# EAGLE design untitled (EAGLE 9.5.2)
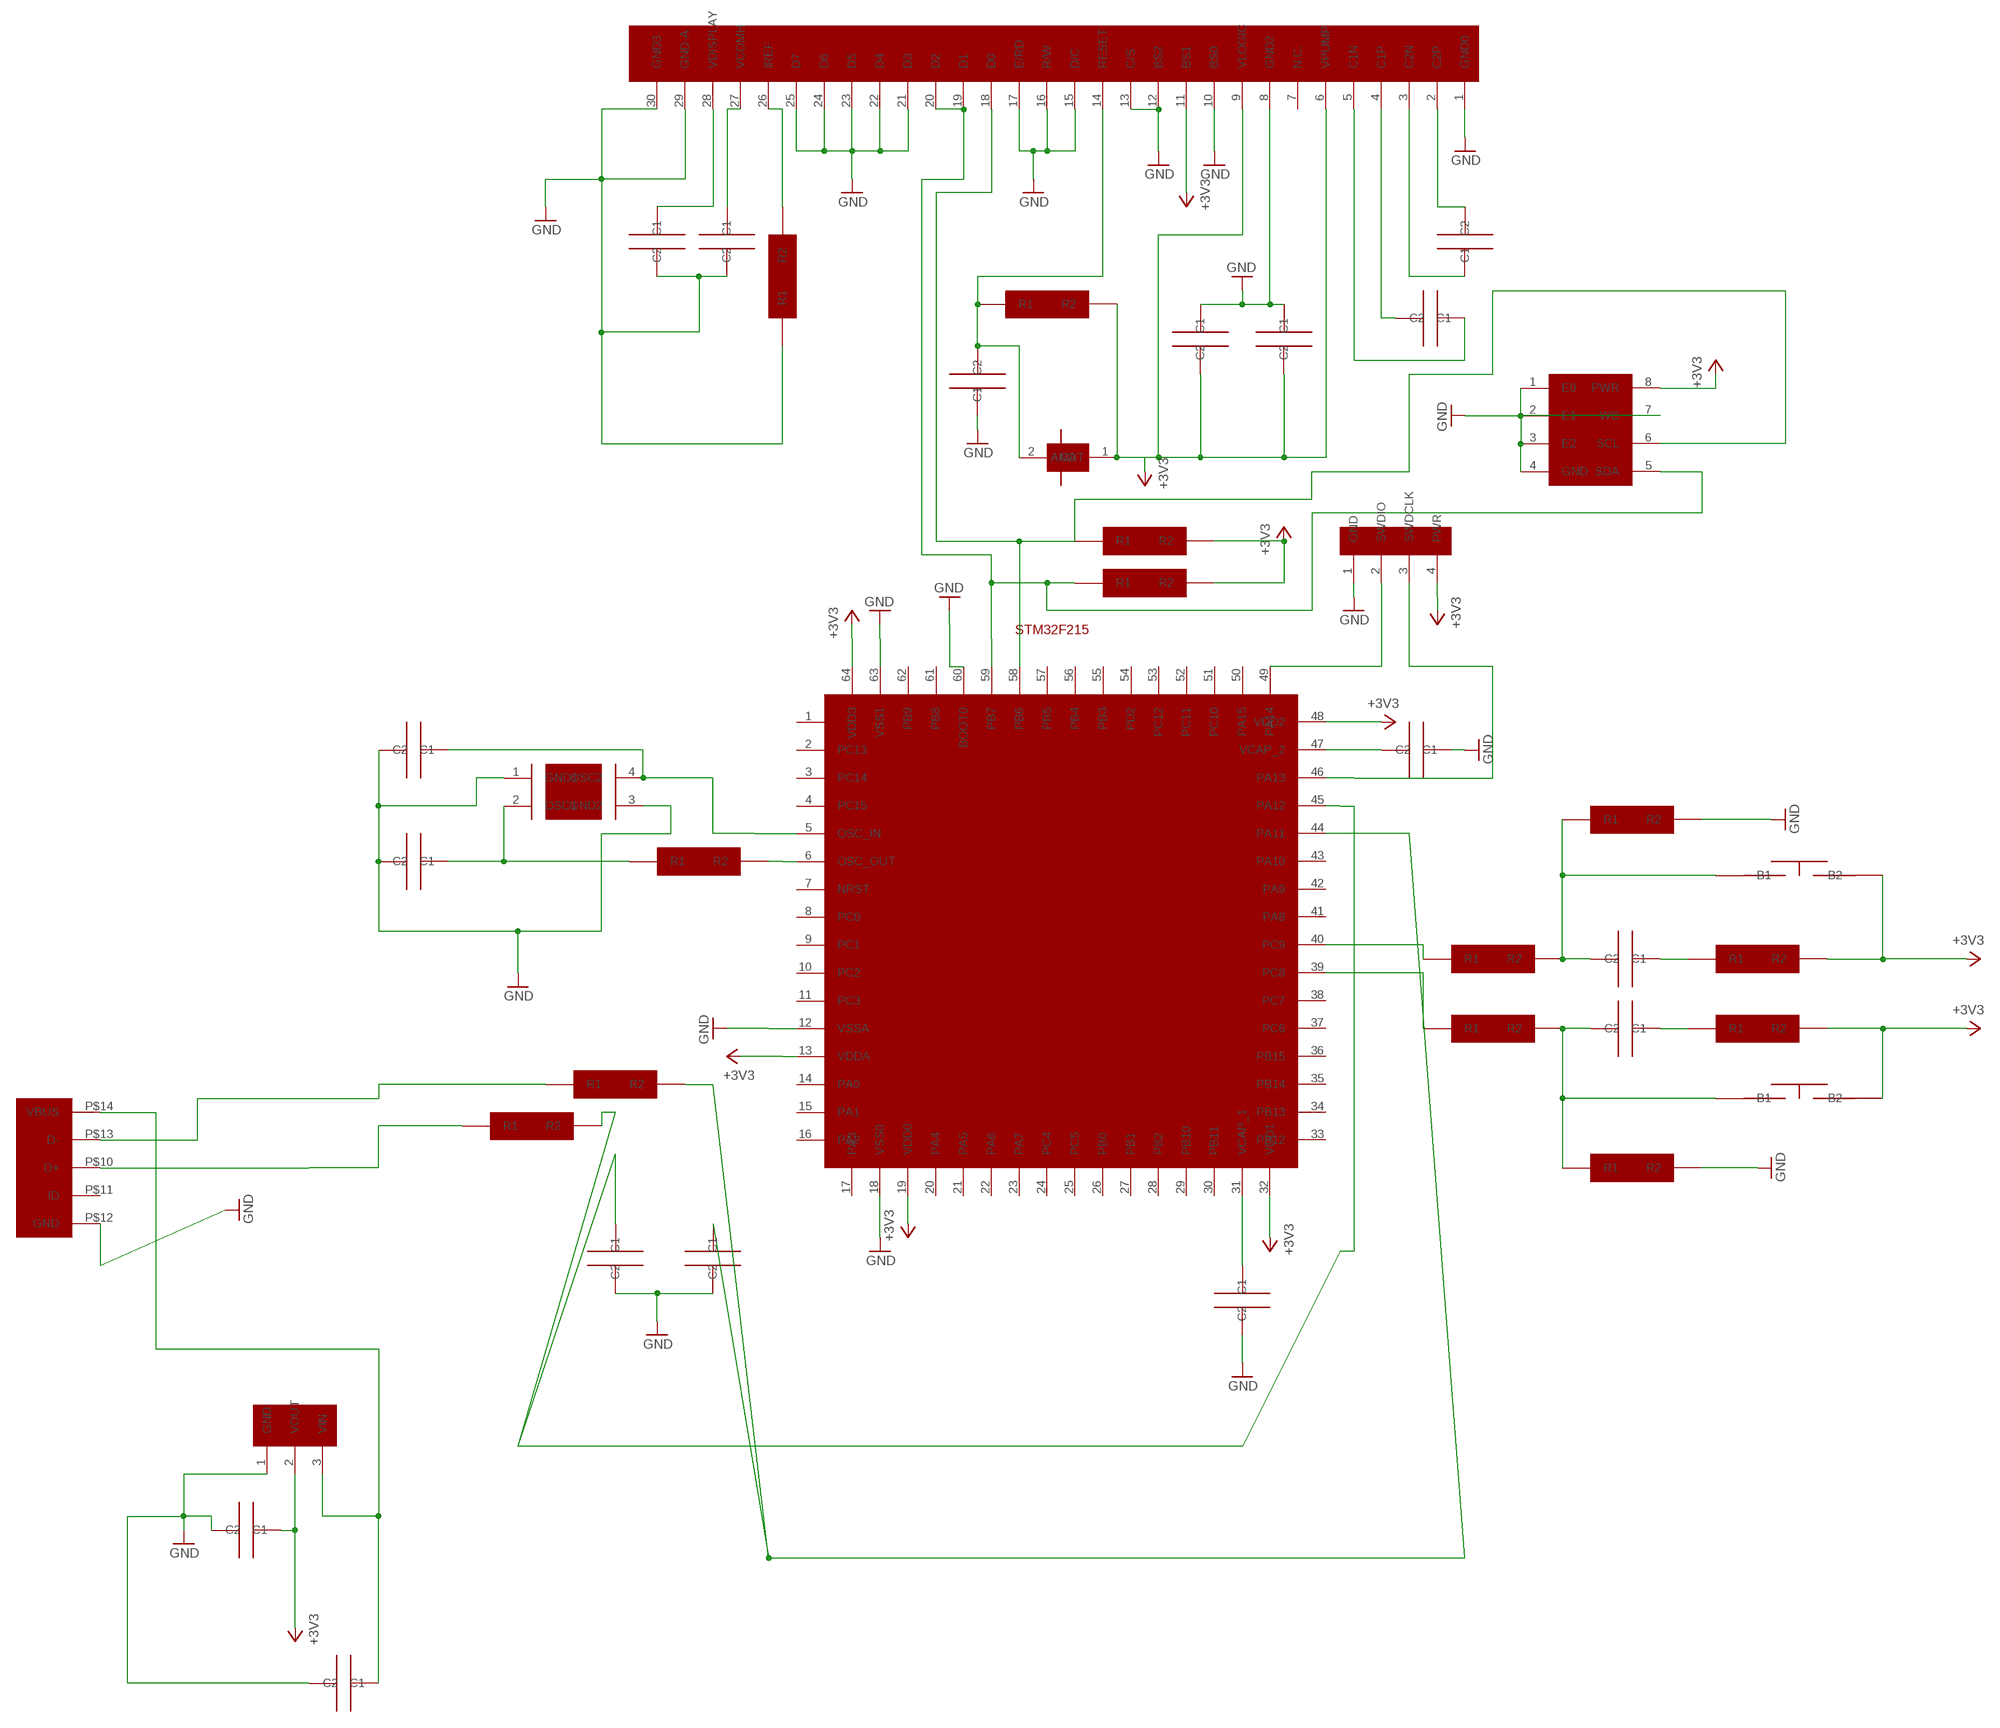
[diagram p0: schematic, sheet 1]

## Parts
C3  10мкф  C0805  [0805]
C4  22мкф  C0805  [0805]
C10  100нф  C0805  [0805]
C11  100нф  C0805  [0805]
C28  8пф  C0805  [0805]
C29  8пф  C0805  [0805]
C30  47пф  C0805  [0805]
C31  47пф  C0805  [0805]
C36  2.2мкф  C0805  [0805]
C37  2.2мкф  C0805  [0805]
C39  1мкф  C0805  [0805]
C40  1мкф  C0805  [0805]
C41  1мкф  C0805  [0805]
C42  1мкф  C0805  [0805]
C44  4.7мкф  C0805  [0805]
C46  2.2мкф  C0805  [0805]
C47  4.7мкф  C0805  [0805]
R2  330  R0805  [0805]
R3  330  R0805  [0805]
R6  100  R0805  [0805]
R7  100  R0805  [0805]
R8  10к  R0805  [0805]
R9  10к  R0805  [0805]
R14  220k  R0805  [0805]
R15  220k  R0805  [0805]
R32  820  R0805  [0805]
R33  22  R0805  [0805]
R34  22  R0805  [0805]
R43  4.7к  R0805  [0805]
R48  910к  R0805  [0805]
U$1  STM32F215RESTM32  [QFP50P1300X1300X120-64N]
U$2  AMS1117  [SOT229P729X180-4N]
U$3  I2CMEMORY  [SOIC127P600X175-8N]
U$4  USBUSBT  [USBT]
U$5  SWDSWDD  [HDRV4W64P254_1X4_1016X508X838B]
U$18  BUTTON  [BUTTON]
U$19  BUTTON  [BUTTON]
U$26  NX2520SA  [NX2520SA]
U$38  SSD1306  [SSD1306]
U$45  ESD  [ESD]

## Nets
+3V3: C4.2(C2) C41.1(C1) C42.1(C1) R6.2(R2) R7.2(R2) R8.2(R2) R9.2(R2) R43.2(R2) U$1.13(VDDA) U$1.19(VDD0) U$1.32(VDD1) U$1.48(VDD2) U$1.64(VDD3) U$2.2(VOUT) U$3.8(PWR) U$5.4(PWR) U$18.2(B2) U$19.2(B2) U$38.6(VPUMP) U$38.9(VLOGIC) U$38.11(BS1) U$45.1(ANO)
GND: C3.1(C1) C4.1(C1) C28.1(C1) C29.1(C1) C30.1(C1) C31.1(C1) C36.1(C1) C37.2(C2) C41.2(C2) C42.2(C2) C44.2(C2) C46.1(C1) C47.1(C1) R14.2(R2) R15.2(R2) R48.1(R1) U$1.12(VSSA) U$1.18(VSS0) U$1.60(BOOT0) U$1.63(VSS1) U$2.1(GND) U$3.1(E0) U$3.2(E1) U$3.3(E2) U$3.4(GND) U$3.7(WC) U$4.P$12(GND) U$5.1(GND) U$26.1(GND1) U$26.3(GND2) U$38.1(GND0) U$38.8(GND2) U$38.10(BS0) U$38.12(BS2) U$38.13(C/S) U$38.15(D/C) U$38.16(R/W) U$38.17(E/RD) U$38.21(D3) U$38.22(D4) U$38.23(D5) U$38.24(D6) U$38.25(D7) U$38.29(GND-A) U$38.30(GND3)
N$1: C30.2(C2) R33.2(R2) U$1.44(PA11)
N$5: C11.1(C1) R3.2(R2) R15.1(R1) U$19.1(B1)
N$6: C11.2(C2) R7.1(R1)
N$7: C10.1(C1) R2.2(R2) R14.1(R1) U$18.1(B1)
N$8: C10.2(C2) R6.1(R1)
N$17: R32.2(R2) U$1.6(OSC_OUT)
N$18: C28.2(C2) U$1.5(OSC_IN) U$26.4(OSC2)
N$19: C29.2(C2) R32.1(R1) U$26.2(OSC1)
N$21: C31.2(C2) R34.2(R2) U$1.45(PA12)
N$22: C36.2(C2) U$1.31(VCAP_1)
N$23: R33.1(R1) U$4.P$13(D-)
N$24: R34.1(R1) U$4.P$10(D+)
N$25: C37.1(C1) U$1.47(VCAP_2)
N$28: R3.1(R1) U$1.39(PC8)
N$29: R2.1(R1) U$1.40(PC9)
N$34: C39.1(C1) U$38.2(C2P)
N$35: C39.2(C2) U$38.3(C2N)
N$36: C40.1(C1) U$38.4(C1P)
N$37: C40.2(C2) U$38.5(C1N)
N$38: C44.1(C1) R43.1(R1) U$38.14(RESET) U$45.2(CAT)
N$40: C3.2(C2) U$2.3(VIN) U$4.P$14(VBUS)
N$43: R48.2(R2) U$38.26(IREF)
N$44: C47.2(C2) U$38.27(VCOMH)
N$45: C46.2(C2) U$38.28(VDISPLAY)
N$47: R9.1(R1) U$1.59(PB7) U$3.5(SDA) U$38.19(D1) U$38.20(D2)
N$48: R8.1(R1) U$1.58(PB6) U$3.6(SCL) U$38.18(D0)
N$51: U$1.49(PA14) U$5.2(SWDIO)
N$52: U$1.46(PA13) U$5.3(SWDCLK)
Unconnected: U$1.2(PC13) U$1.3(PC14) U$1.4(PC15) U$1.7(NRST) U$1.8(PC0) U$1.9(PC1) U$1.10(PC2) U$1.11(PC3) U$1.14(PA0) U$1.15(PA1) U$1.16(PA2) U$1.17(PA3) U$1.20(PA4) U$1.21(PA5) U$1.22(PA6) U$1.23(PA7) U$1.24(PC4) U$1.25(PC5) U$1.26(PB0) U$1.27(PB1) U$1.28(PB2) U$1.29(PB10) U$1.30(PB11) U$1.33(PB12) U$1.34(PB13) U$1.35(PB14) U$1.36(PB15) U$1.37(PC6) U$1.38(PC7) U$1.41(PA8) U$1.42(PA9) U$1.43(PA10) U$1.50(PA15) U$1.51(PC10) U$1.52(PC11) U$1.53(PC12) U$1.54(PD2) U$1.55(PB3) U$1.56(PB4) U$1.57(PB5) U$1.61(PB8) U$1.62(PB9) U$4.P$11(ID) U$38.7(N.C.)

## Power pins joined to a net without a drawn wire
VBAT: U$1.1(VBAT)

## Library data of the parts
C3 C4 C10 C11 C28-C31 C36 C37 C39-C42 C44 C46 C47 = IDMLib:C0805
R2 R3 R6-R9 R14 R15 R32-R34 R43 R48 = IDMLib:R0805
U$1 = IDMLib:STM32F215RE
U$2 = IDMLib:AMS1117
U$3 = IDMLib:I2CMEMORY
U$4 = IDMLib:USB
U$5 = IDMLib:SWD
U$18 U$19 = IDMLib:BUTTON
U$26 = IDMLib:NX2520SA
U$38 = IDMLib:SSD1306
U$45 = IDMLib:ESD

## Board
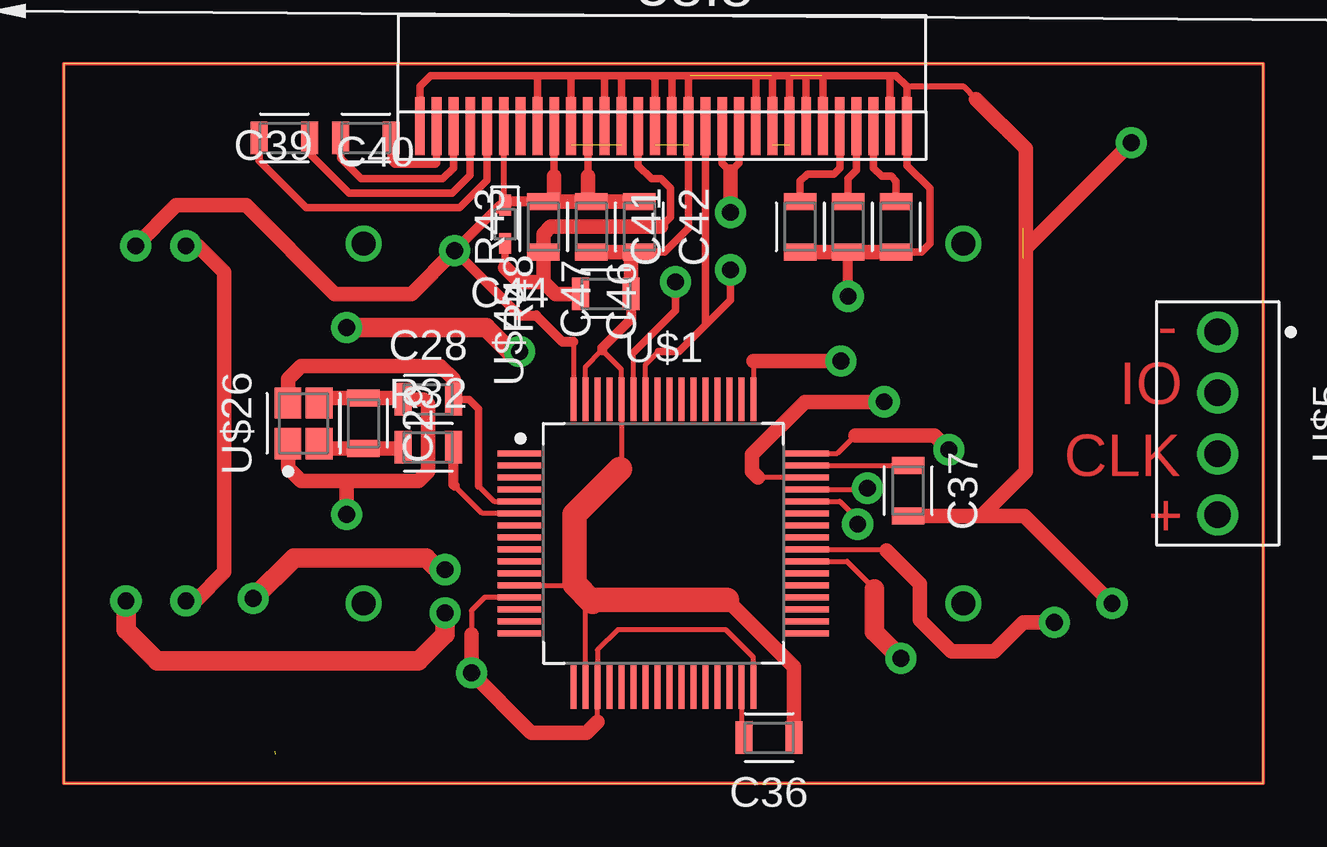
[diagram p1: board, top side]
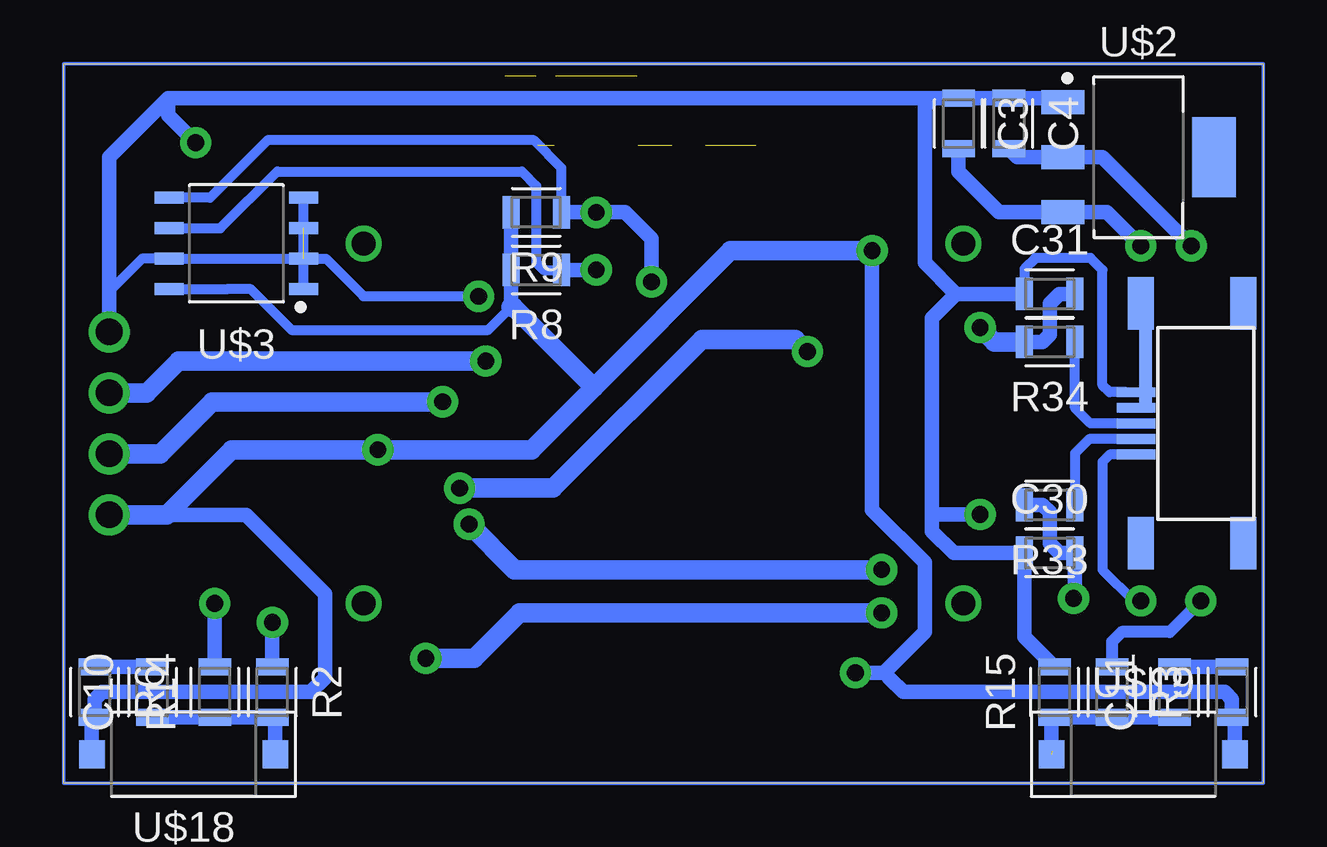
[diagram p2: board, bottom side, seen from below]

Size 50 x 30 mm. Coordinates in mm from the lower left corner, seen from the top.
Outline: 0,0 50,0 50,30 0,30 0,0
Copper layers (1*16): Top 0.035mm / dielectric 1.5mm / Bottom 0.035mm
Design rules "default": minimum track width 6mil, minimum drill 0.35mm, track to track 6mil, track to pad 6mil, pad to pad 6mil, via to via 6mil, smd to smd 6mil, copper to edge 40mil, drill to drill 6mil, minimum pad ring 10mil, minimum via ring 8mil, stop-mask expansion 4mil, vias tented up to drill 0mil, thermal gap 10mil

### Footprints (pad centres in the part's own frame; a part is rotated, then mirrored left to right if it is on the bottom)
0805 = smd 0.712 x 1.362: 1 -1.05,0; 2 1.05,0
QFP50P1300X1300X120-64N = smd 1.812 x 0.242: 1 -6,3.75; 2 -6,3.25; 3 -6,2.75; 4 -6,2.25; 5 -6,1.75; 6 -6,1.25; 7 -6,0.75; 8 -6,0.25; 9 -6,-0.25; 10 -6,-0.75; 11 -6,-1.25; 12 -6,-1.75; 13 -6,-2.25; 14 -6,-2.75; 15 -6,-3.25; 16 -6,-3.75; 33 6,-3.75; 34 6,-3.25; 35 6,-2.75; 36 6,-2.25; 37 6,-1.75; 38 6,-1.25; 39 6,-0.75; 40 6,-0.25; 41 6,0.25; 42 6,0.75; 43 6,1.25; 44 6,1.75; 45 6,2.25; 46 6,2.75; 47 6,3.25; 48 6,3.75 | smd 0.242 x 1.812: 17 -3.75,-6; 18 -3.25,-6; 19 -2.75,-6; 20 -2.25,-6; 21 -1.75,-6; 22 -1.25,-6; 23 -0.75,-6; 24 -0.25,-6; 25 0.25,-6; 26 0.75,-6; 27 1.25,-6; 28 1.75,-6; 29 2.25,-6; 30 2.75,-6; 31 3.25,-6; 32 3.75,-6; 49 3.75,6; 50 3.25,6; 51 2.75,6; 52 2.25,6; 53 1.75,6; 54 1.25,6; 55 0.75,6; 56 0.25,6; 57 -0.25,6; 58 -0.75,6; 59 -1.25,6; 60 -1.75,6; 61 -2.25,6; 62 -2.75,6; 63 -3.25,6; 64 -3.75,6
SOT229P729X180-4N = smd 1.803 x 1.012: 1 -3.15,2.29; 2 -3.15,0; 3 -3.15,-2.29 | smd 1.803 x 3.322: 4 3.15,0
SOIC127P600X175-8N = smd 1.212 x 0.502: 1 -2.8,1.905; 2 -2.8,0.635; 3 -2.8,-0.635; 4 -2.8,-1.905; 5 2.8,-1.905; 6 2.8,-0.635; 7 2.8,0.635; 8 2.8,1.905
USBT = smd 2.184 x 1.067: P$1 5,1.57; P$2 -5,1.57; P$3 -5,-2.7; P$4 5,-2.7 | smd 0.406 x 0.813: P$5 0,-2.5; P$6 -0.65,-2.5; P$7 0.65,-2.5; P$8 1.3,-2.5; P$9 -1.3,-2.5; P$10 0,-3.3; P$11 -0.65,-3.3; P$12 -1.3,-3.3; P$13 0.65,-3.3; P$14 1.3,-3.3 | smd 1.016 x 0.508: P$15 -1.35,-2.5; P$16 -2.35,-2.5; P$17 -3.35,-2.5; P$18 -4.1,-2.5
HDRV4W64P254_1X4_1016X508X838B = drill 1.105 pad 1.705: 1 -3.81,0; 2 -1.27,0; 3 1.27,0; 4 3.81,0
BUTTON = smd 1.062 x 1.172: 1 -3.825,0; 2 3.825,0
NX2520SA = smd 1.312 x 1.112: 1 -0.85,0.65; 2 -0.85,-0.65; 3 0.85,-0.65; 4 0.85,0.65
SSD1306 = smd 0.406 x 0.813: 1 -10.1,-0.4; 2 -9.4,-0.4; 3 -8.7,-0.4; 4 -8,-0.4; 5 -7.3,-0.4; 6 -6.6,-0.4; 7 -5.9,-0.4; 8 -5.2,-0.4; 9 -4.5,-0.4; 10 -3.8,-0.4; 11 -3.1,-0.4; 12 -2.4,-0.4; 13 -1.7,-0.4; 14 -1,-0.4; 15 -0.3,-0.4; 16 0.4,-0.4; 17 1.1,-0.4; 18 1.8,-0.4; 19 2.5,-0.4; 20 3.2,-0.4; 21 3.9,-0.4; 22 4.6,-0.4; 23 5.3,-0.4; 24 6,-0.4; 25 6.7,-0.4; 26 7.4,-0.4; 27 8.1,-0.4; 28 8.8,-0.4; 29 9.5,-0.4; 30 10.2,-0.4; P$1 -10.1,0.4; P$2 -9.4,0.4; P$3 -8.7,0.4; P$4 -8,0.4; P$5 -7.3,0.4; P$6 -6.6,0.4; P$7 -5.9,0.4; P$8 -5.2,0.4; P$9 -4.5,0.4; P$10 -3.8,0.4; P$11 -3.1,0.4; P$12 -2.4,0.4; P$13 -1.7,0.4; P$14 -1,0.4; P$15 -0.3,0.4; P$16 0.4,0.4; P$17 1.1,0.4; P$18 1.8,0.4; P$19 2.5,0.4; P$20 3.2,0.4; P$21 3.9,0.4; P$22 4.6,0.4; P$23 5.3,0.4; P$24 6,0.4; P$25 6.7,0.4; P$26 7.4,0.4; P$27 8.1,0.4; P$28 8.8,0.4; P$29 9.5,0.4; P$30 10.2,0.4; P$31 -10.1,1.2; P$32 -9.4,1.2; P$33 -8.7,1.2; P$34 -8,1.2; P$35 -7.3,1.2; P$36 -6.6,1.2; P$37 -5.9,1.2; P$38 -5.2,1.2; P$39 -4.5,1.2; P$40 -3.8,1.2; P$41 -3.1,1.2; P$42 -2.4,1.2; P$43 -1.7,1.2; P$44 -1,1.2; P$45 -0.3,1.2; P$46 0.4,1.2; P$47 1.1,1.2; P$48 1.8,1.2; P$49 2.5,1.2; P$50 3.2,1.2; P$51 3.9,1.2; P$52 4.6,1.2; P$53 5.3,1.2; P$54 6,1.2; P$55 6.7,1.2; P$56 7.4,1.2; P$57 8.1,1.2; P$58 8.8,1.2; P$59 9.5,1.2; P$60 10.2,1.2
ESD = smd 0.862 x 0.512: 1 -0.8,0; 2 0.8,0

### Placement (x,y rotation side)
C3  12.7,27.5 270 bottom
C4  10.6,27.5 270 bottom
C10  46.3,3.8 90 bottom
C11  3.7,3.8 90 bottom
C28  15.2,16 0 top
C29  12.5,15 270 top
C30  8.9,9.6 0 bottom
C31  8.9,20.4 0 bottom
C36  29.4,1.9 180 top
C37  35.2,12.2 270 top
C39  12.6,26.9 180 top
C40  9.2,26.9 180 top
C41  22,23.2 270 top
C42  24,23.2 270 top
C44  22.6,20.4 0 top
C46  34.7,23.2 90 top
C47  32.7,23.2 90 top
R2  41.3,3.8 270 bottom
R3  6.3,3.8 270 bottom
R6  48.7,3.8 270 bottom
R7  1.3,3.8 270 bottom
R8  30.3,21.4 180 bottom
R9  30.3,23.8 180 bottom
R14  43.7,3.8 90 bottom
R15  8.7,3.8 90 bottom
R32  15.2,14 0 top
R33  8.9,11.6 180 bottom
R34  8.9,18.4 180 bottom
R43  20,23.2 90 top
R48  30.7,23.2 90 top
U$1  25,10 0 top
U$2  5.2,26.1 0 bottom
U$3  42.8,22.5 180 bottom
U$4  2.4,15 270 bottom
U$5  48.1,15 270 top
U$18  45,1.2 180 bottom
U$19  5,1.2 0 bottom
U$26  10,15 90 top
U$38  24.95,27 0 top
U$45  18.4,23.3 270 top

### Tracks (layer width: path | path; a pad name or v marks a point on that pad's centre or on a via)
+3V3  (via drill 0.7 pad 1.3)
  Top 0.2: U$1.13 17.55,7.75 17,7.2 17,6.2 | 19.45,2.15 19.5,2.1 | 22.25,2.55 U$1.19
  Top 0.203: 21.25,18.4 U$1.64 | U$1.48 32.25,13.75 33,14.5 | U$1.32 28.75,5.25 27.6,6.4 23.1,6.4 22.25,5.55 U$1.19
  Top 0.254: U$45.1 18.35,24.15 18.35,24.3 U$38.6
  Top 0.305: U$38.9 20.45,25.3 | 21.85,25.3 U$38.11
  Top 0.406: R43.2 18.4,24.25 18.35,24.3 | U$45.1 18.2,24.1 v16.3,22.2 19,19.5 19.7,19.5 20.8,18.4 21.25,18.4
  Top 0.61: R43.2 20.4,24.25 | 20.4,24.25 C41.1 | C41.1 C42.1 | v16.3,22.2 14.5,20.4 11.3,20.4 7.6,24.1 4.7,24.1 v3,22.4 | 19.45,2.15 v17,4.6 17,6.2 | 19.5,2.1 21.8,2.1 22.25,2.55 | v36.9,13.9 36.3,14.5 33,14.5 | C41.1 21.85,24.4 21.85,25.3 | 20.45,25.3 20.45,24.3 20.4,24.25
  Bottom 0.254: 15.8,4.6 15.6,4.4 | 1.6,3.8 1.7,3.8 | 42.39,11.19 46.2,11.19
  Bottom 0.406: U$3.8 43.2,20.6 42.2,20.6 40.5,18.9 32.3,18.9 31.35,19.85 R8.2 | 48.4,3.8 48.7,3.5
  Bottom 0.61: U$19.2 1.18,2.62 R7.2 1.3,3.5 1.6,3.8 | U$18.2 48.83,2.62 R6.2 48.7,3.5 | C4.2 10.25,26.1 U$2.2 6.7,26.1 v3,22.4 | R9.2 R8.2 31.35,19.95 31.25,19.85 | v17,4.6 15.8,4.6 14.1,6.3 14.1,9.2 16.3,11.4 v16.3,22.2 | 45.71,11.19 42.39,11.19 39.1,7.9 39.1,4.4 39.7,3.8 48.4,3.8 48.68,3.52 48.68,3.5 | 15.6,4.4 15,3.8 1.7,3.8
  Bottom 0.813: U$5.4 46.2,11.19 45.71,11.19 43,13.9 v36.9,13.9 30.5,13.9 27.9,16.5 | 27.9,16.5 22.2,22.2 v16.3,22.2 | 31.35,19.85 31.25,19.85 27.9,16.5
GND  (via drill 0.7 pad 1.3)  (10 unrouted)
  Top 0.2: U$1.60 23.25,13.15 23.2,13.1
  Top 0.203: U$1.63 21.75,17.35 22.45,18.05 23.25,17.25 U$1.60 | U$1.12 21.35,8.25 21.3,8.3 | U$1.18 21.75,7.25 22.05,7.55
  Top 0.254: 35.15,29.05 37.5,29.05 38.02,28.53
  Top 0.305: 19.8,29.5 15.3,29.5 14.85,29.05 U$38.1 | 34.5,29.5 34.7,29.5 35.15,29.05 U$38.30 35.15,25.75 36.1,24.8 36.1,22.5 35.75,22.15 C46.1 | 34.5,29.5 24.5,29.5 | 24.5,29.5 21.2,29.5 | 21.2,29.5 19.8,29.5 | C42.2 25.05,22.15 26.05,23.15 U$38.17 26.05,29.45 26.1,29.5 | 19.8,29.5 19.75,29.45 U$38.8 | 21.2,29.5 21.15,29.45 U$38.10 | 22.5,29.5 22.55,29.45 U$38.12 | 23.3,29.5 23.25,29.45 U$38.13 | 24.5,29.5 24.65,29.35 U$38.15 | 25.3,29.5 25.35,29.45 U$38.16 | 28.8,29.5 28.85,29.45 U$38.21 | 29.5,29.5 29.55,29.45 U$38.22 | 30.3,29.5 30.25,29.45 U$38.23 | 30.9,29.5 30.95,29.45 U$38.24 | 31.6,29.5 31.65,29.45 U$38.25 | 34.5,29.5 34.45,29.45 U$38.29
  Top 0.406: v32.7,20.3 C47.1 | C44.2 23.65,19.35 22.45,18.15 22.45,18.05 | U$38.8 19.75,26.64
  Top 0.61: U$26.3 10.85,16.05 C29.1 14.1,16.05 C28.1 15,16 15.2,15.8 15.2,13 14.8,12.6 11.8,12.6 | U$26.1 9.35,13.15 9.9,12.6 11.8,12.6 | C42.2 23.7,22.15 | 23.7,22.15 C41.2 | C44.2 23.65,22.1 23.7,22.15 | R48.1 C47.1 C46.1 | v11.8,11.2 11.8,12.6 | C37.2 38.25,11.15 | v44.5,26.7 40.1,22.3 | 38.25,11.15 40.1,13 40.1,22.3 | 38.25,11.15 40.05,11.15 v43.7,7.5 | 40.1,22.3 40.1,26.45 38.02,28.53 | C36.1 30.45,4.85 27.65,7.65
  Top 1.016: 23.2,13.1 21.3,11.2 21.3,8.3 | 21.35,8.25 21.95,7.65 | 21.95,7.65 22.05,7.55 | 21.95,7.65 27.65,7.65
  Bottom 0.406: U$4.P$12 6.4,16.3 6.7,16.6 6.7,21.4 7.2,21.9 9.5,21.9 9.95,21.45 C31.1 | U$3.1 40,21.8 | 40,21.8 U$3.4 | 40,21.8 40.06,21.87 U$3.7 46.73,21.87 48.1,20.5 U$5.1 | U$3.2 39.06,21.87 37.5,20.3 v32.7,20.3
  Bottom 0.61: C3.1 C4.1 8.51,28.55 U$2.1 8.26,28.3 | C3.1 13.75,28.55 14.1,28.2 14.1,21.7 12.8,20.4 | C31.1 12.8,20.4 | C3.1 45.65,28.55 | U$5.1 48.1,26.1 45.65,28.55 | 12.8,20.4 13.8,19.4 13.8,11.3 | 13.8,11.3 13.8,10.5 12.9,9.6 C30.1 9.95,6.1 R15.2 | 13.8,11.3 13.7,11.2 v11.8,11.2 | v44.5,26.7 45.65,27.85 45.65,28.55 | v43.7,7.5 R14.2
N$1  (via drill 0.7 pad 1.3)
  Top 0.2: U$1.44 32.35,11.75 33.1,11 v33.1,10.8
  Top 0.813: v7.9,7.7 9.6,9.4 15.1,9.4 15.6,8.9 v15.9,8.9
  Bottom 0.61: R33.2 9.2,11.6 8.9,11.3 8.9,10 8.5,9.6 C30.2 7.85,7.75 v7.9,7.7
  Bottom 0.813: v15.9,8.9 31.2,8.9 v33.1,10.8
N$2  (via drill 1 pad 1.3)
  other vias: 12.5,22.5
N$3
  Top 0.152: 0,30 0,0 50,0 50,30 0,30
N$4  (via drill 1 pad 1.3)
  other vias: 37.5,22.5
N$5  (1 unrouted)
  Bottom 0.61: 8.8,1.32 8.83,1.32 8.83,2.62 R15.1 R3.2 C11.1
N$6
  Bottom 0.61: R7.1 C11.2
N$7
  Bottom 0.61: U$18.1 41.17,2.62 R2.2 R14.1 C10.1
N$8
  Bottom 0.152: R6.1 C10.2
  Bottom 0.61: C10.2 48.68,4.85
N$9
  Bottom 0.152: 0,0 0,30 50,30 50,0 0,0
N$10  (via drill 1 pad 1.3)
  other vias: 37.5,7.5
N$11  (via drill 1 pad 1.3)
  other vias: 12.5,7.5
N$17
  Top 0.2: U$1.6 17.45,11.25 16.3,12.4
  Top 0.406: 16.3,12.4 16.25,12.45 R32.2
N$18
  Top 0.2: 17.3,12.4 17.95,11.75 U$1.5
  Top 0.305: C28.2 16.9,16 17.3,15.6 17.3,12.4
  Top 0.61: U$26.4 9.35,16.85 9.9,17.4 15.7,17.4 16.25,16.85 C28.2
N$19
  Top 0.61: R32.1 14.1,13.95 C29.2 10.85,13.95 U$26.2
N$21  (via drill 0.7 pad 1.3)
  Top 0.2: U$1.45 33.45,12.25 v33.5,12.3
  Top 0.813: v19,18 18.6,18 17.6,19 v11.8,19
  Bottom 0.61: C31.2 8.5,20.4 8.9,20 8.9,18.7 9.2,18.4 R34.2
  Bottom 0.813: v33.5,12.3 29.6,12.3 23.4,18.5 19.5,18.5 v19,18 | v11.8,19 11.2,18.4 R34.2
N$22
  Top 0.203: U$1.31 28.25,2 C36.2
N$23
  Bottom 0.406: U$4.P$13 7.25,14.35 7.85,13.75 R33.1
N$24
  Bottom 0.406: U$4.P$10 7.2,15 7.85,15.65 R34.1
N$25
  Top 0.2: U$1.47 C37.1
N$28  (via drill 0.7 pad 1.3)
  Top 0.2: U$1.39 32.65,9.25 33.8,8.1
  Top 0.813: 33.8,8.1 33.8,6.3 v34.9,5.2 | v15.9,7.1 15.9,6.2 14.8,5.1 3.9,5.1 2.6,6.4 v2.6,7.6
  Bottom 0.508: v2.6,7.6 3.9,6.3 5.9,6.3 6.3,5.9 R3.1
  Bottom 0.813: v34.9,5.2 32.9,5.2 31,7.1 v15.9,7.1
N$29  (via drill 0.7 pad 1.3)
  Top 0.203: U$1.40 34.25,9.75 34.3,9.7
  Top 0.61: 34.3,9.7 35.7,8.3 35.7,6.8 37,5.5 38.8,5.5 40,6.7 v41.3,6.7
  Bottom 0.61: R2.1 v41.3,6.7
N$34
  Top 0.305: U$38.2 15.55,25.85 15.5,25.8 13.8,25.8 13.65,25.95 C39.1
N$35
  Top 0.305: U$38.3 16.25,25.65 15.8,25.2 12.4,25.2 11.55,26.05 C39.2
N$36
  Top 0.305: U$38.4 16.95,25.35 16.2,24.6 11.9,24.6 10.25,26.25 C40.1
N$37
  Top 0.305: C40.2 8.15,25.95 10.1,24 16.5,24 17.65,25.15 U$38.5
N$38
  Top 0.305: 18.4,21.5 U$45.2 | U$38.14 23.95,25.75 24.5,25.2 24.9,25.2 25.3,24.8 25.3,23.6 24.9,23.2
  Top 0.61: C44.1 20.5,20.4 20,20.9 | 20,20.9 R43.1 20,22.9 20.3,23.2 24.9,23.2 | 20,20.9 19,20.9 18.4,21.5
N$40  (via drill 0.7 pad 1.3)
  Top 0.61: v5.1,22.4 5.6,22.4 6.7,21.3 6.7,8.8 5.5,7.6 v5.1,7.6
  Bottom 0.406: U$4.P$14 6.4,13.7 6.7,13.4 6.7,8.9 5.4,7.6 v5.1,7.6
  Bottom 0.61: C3.2 12.7,25.5 11.01,23.81 U$2.3 6.51,23.81 v5.1,22.4
N$43
  Top 0.305: U$38.26 32.35,25.65 32.1,25.4 31,25.4 30.7,25.1 R48.2
N$44
  Top 0.305: U$38.27 33.05,25.55 32.7,25.2 C47.2
N$45
  Top 0.305: U$38.28 33.75,25.65 34.1,25.3 34.5,25.3 34.7,25.1 C46.2
N$47  (via drill 0.7 pad 1.3)
  Top 0.203: U$1.59 23.75,17.95 23.8,18
  Top 0.305: U$38.19 27.45,25.85 27.8,25.5 28.15,25.85 U$38.20 | 23.8,18 25.5,19.7 v25.5,20.9
  Top 0.61: v27.8,23.8 27.8,25.5
  Bottom 0.406: R9.1 29.25,25.65 30.4,26.8 41.5,26.8 43.89,24.41 U$3.5
  Bottom 0.61: R9.1 v27.8,23.8 26.6,23.8 25.5,22.7 v25.5,20.9
N$48  (via drill 0.7 pad 1.3)
  Top 0.203: U$1.58 24.25,17.45 24.8,18
  Top 0.305: U$38.18 26.75,19.1 | 26.75,19.1 25.65,18 24.8,18 | 26.75,19.1 27.8,20.15 v27.8,21.4
  Bottom 0.406: U$3.6 43.47,23.14 41.1,25.5 30.9,25.5 30.3,24.9 30.3,21.7 30,21.4 R8.1
  Bottom 0.61: R8.1 v27.8,21.4
N$51  (via drill 0.7 pad 1.3)
  Top 0.2: 28.75,17.6 U$1.49
  Top 0.61: v32.4,17.6 28.75,17.6
  Bottom 0.813: U$5.2 46.53,16.27 45.2,17.6 v32.4,17.6
N$52  (via drill 0.7 pad 1.3)
  Top 0.2: U$1.46 28.95,12.75 | 28.7,13.1 28.7,13
  Top 0.61: v34.2,15.9 30.9,15.9 28.7,13.7 28.7,13.1 | 28.7,13 28.95,12.75
  Bottom 0.813: v34.2,15.9 43.8,15.9 45.97,13.73 U$5.3

### Text on the board
Top: - | IO | CLK | +